# EasyEDA schematic SCH_TestPCB_2024-04-18.json
TITLE: FletchVR; REV: 1.0; Date: 2024-02-04; Sheet: 1/1; Drawn By: Fletchworks; Company: Fletchworks
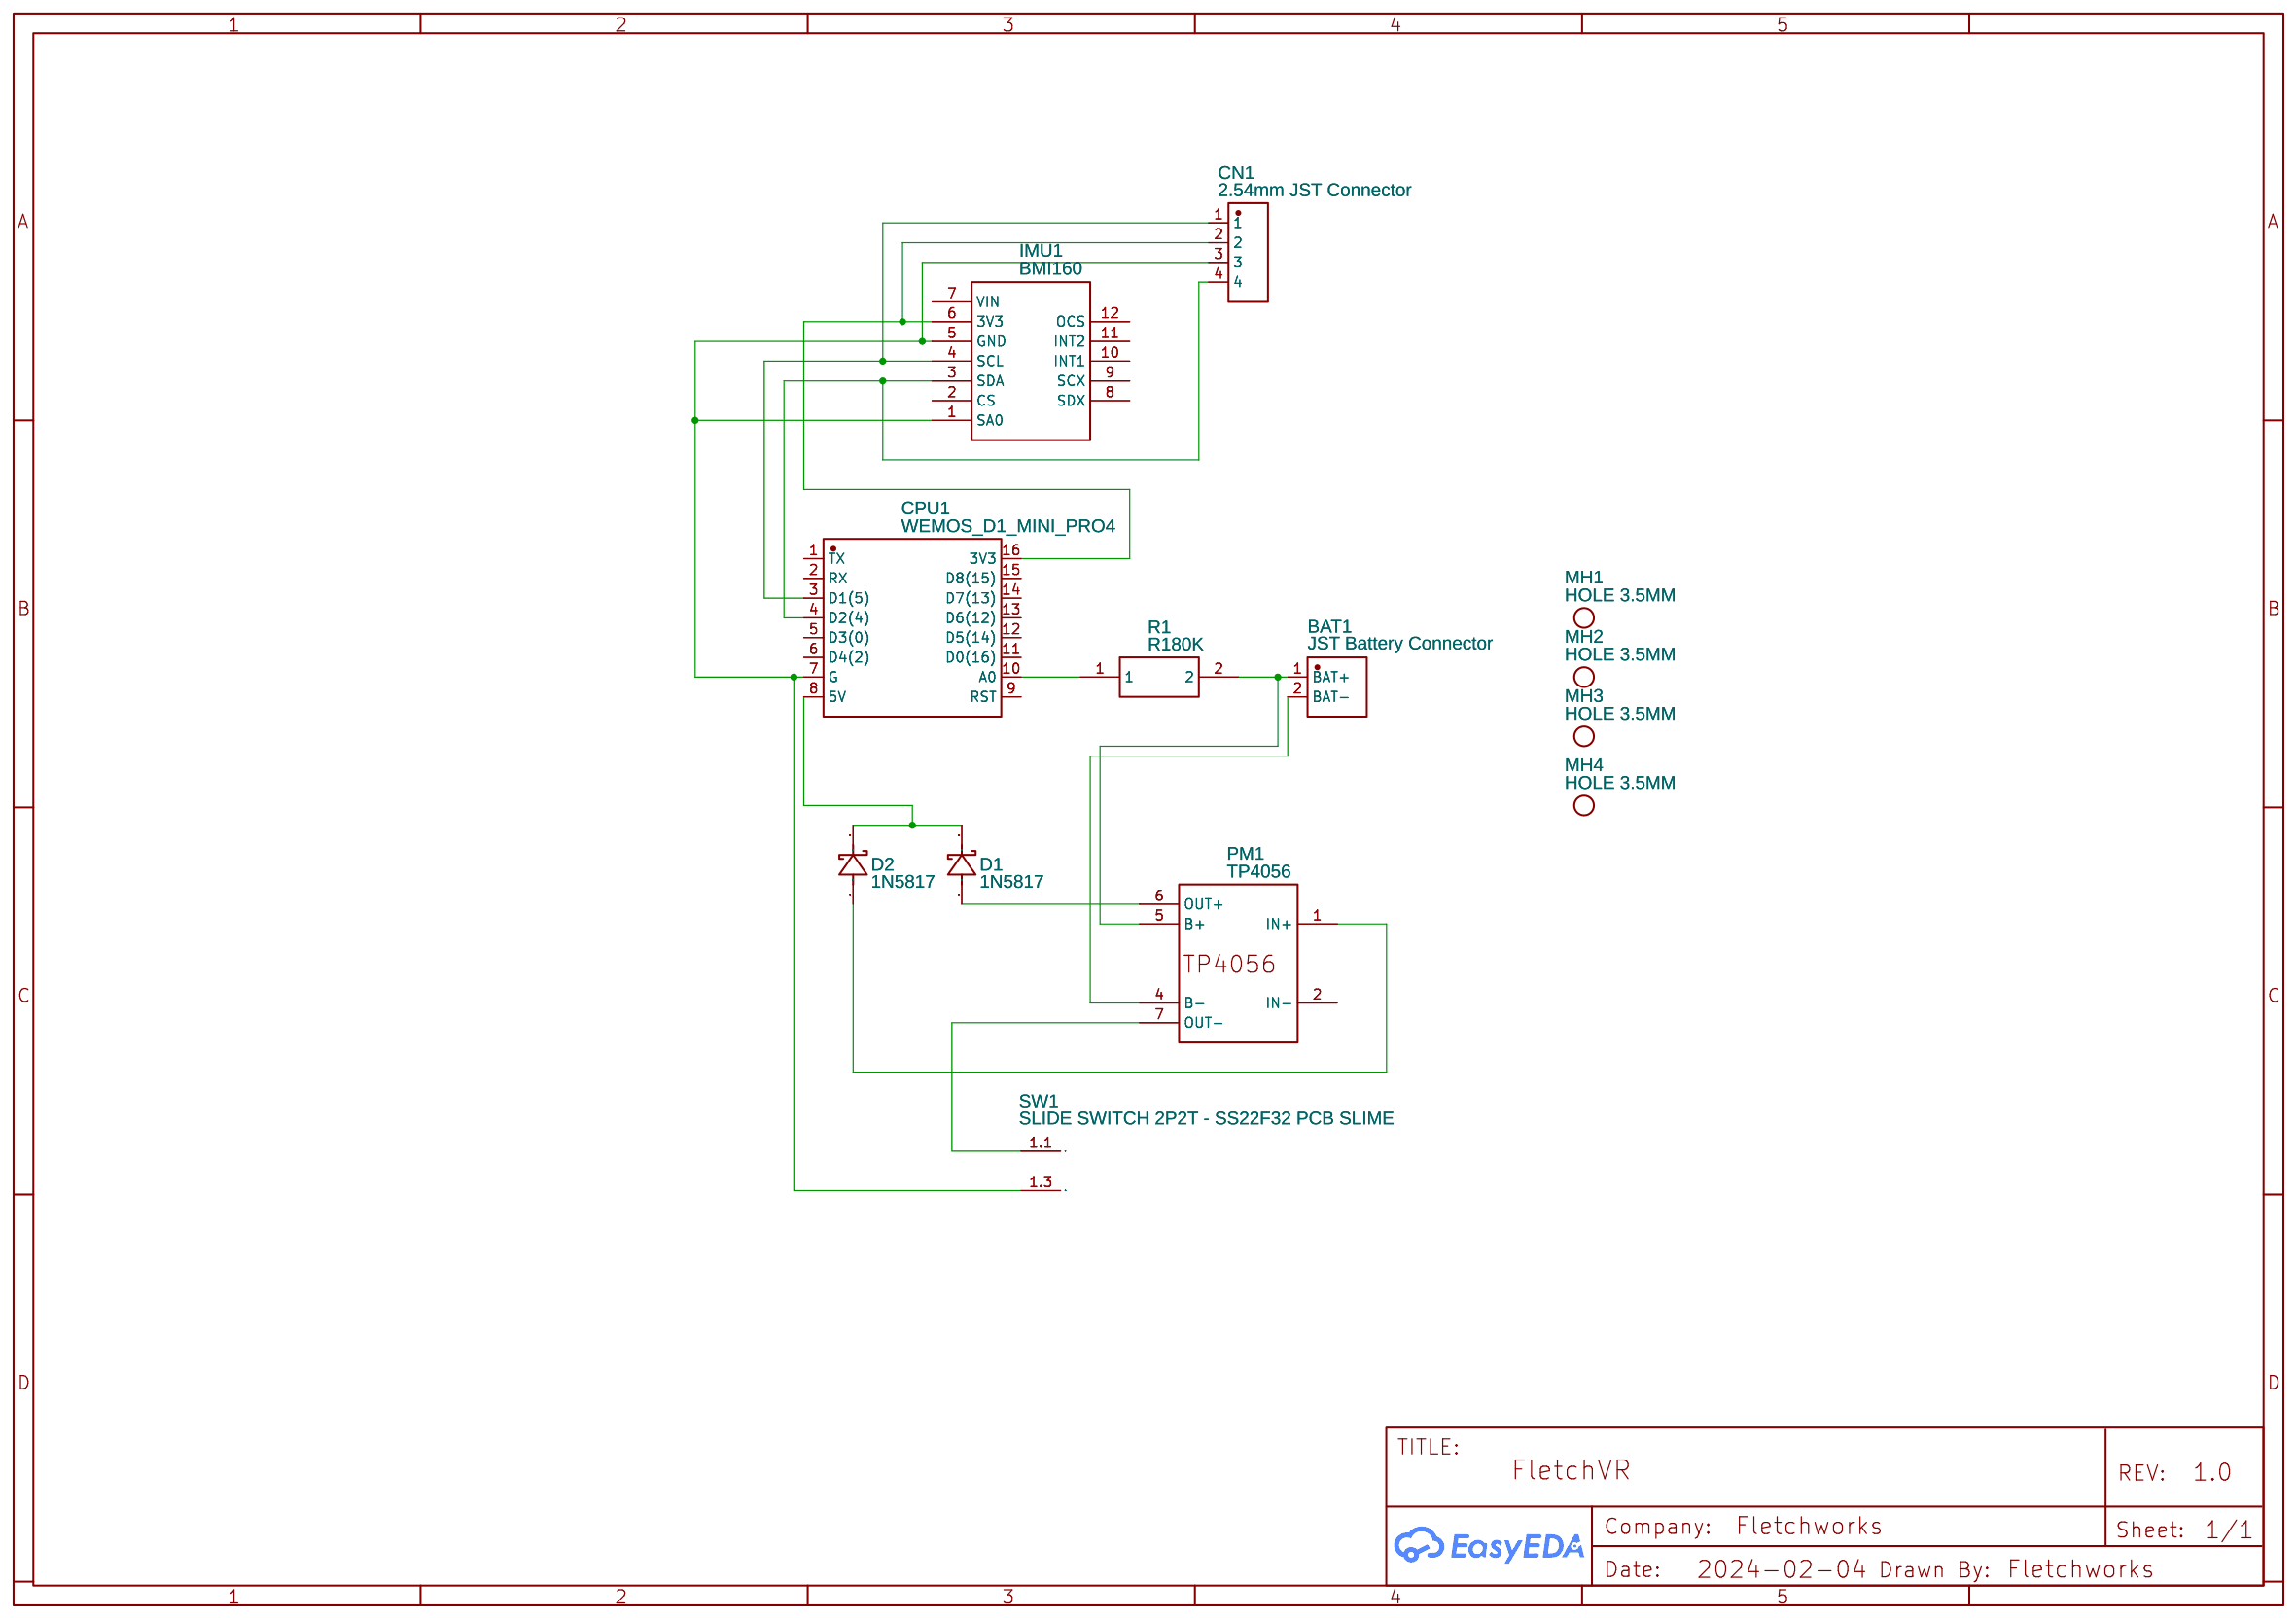
[diagram p0: schematic sheet]

## Parts
BAT1  JST Battery Connector  [JST-PH-JST-PH2]
CN1  2.54mm JST Connector  [CONN-TH_4P-P2.54_XH-AW-2.54MM-4P]
CPU1  WEMOS_D1_MINI_PRO4  [DIP-16_WEMOS_D1_MINI_PRO4]
D1  1N5817  [1N5817_THROUGH]
D2  1N5817  [1N5817_THROUGH]
IMU1  BMI160  [BMI160]
MH1  HOLE 3.5MM  [HOLE-3.5MM]
MH2  HOLE 3.5MM  [HOLE-3.5MM]
MH3  HOLE 3.5MM  [HOLE-3.5MM]
MH4  HOLE 3.5MM  [HOLE-3.5MM]
PM1  TP4056  [TP4056-SIZ]
R1  R180K  [ER RESISTOR 180K/0.6 W]
SW1  SLIDE SWITCH 2P2T - SS22F32 PCB SLIME  [2P2T-SS22F32]

## Library data of the parts
BAT1 = JST-PH-JST-PH2 COPY: Contributor: julian.boet
CN1 = XH-AW-2.54MM-4P: Contributor: lcsc; Supplier: LCSC; Supplier Part: C9900018797; Manufacturer: null; JLCPCB Part Class: Extended Part
CPU1 = WEMOS_D1_MINI_PRO4: Contributor: LCSC; Supplier: LCSC; Supplier Part: C2837266; Manufacturer: null; Manufacturer Part: Wemos_D1_mini_Pro4; JLCPCB Part Class: Extended Part
D1 D2 = 1N5817: Contributor: siddharth13sahu
IMU1 = BMI160: Contributor: katze2005
MH1-MH4 = HOLE 3.5MM: Contributor: Ahmad Ahmad Kassem
PM1 = TP4056-siz: Manufacturer Part: TP4056-protect; link: https://dlnmh9ip6v2uc.cloudfront.net/datasheets/Prototyping/TP4056.pdf; Contributor: klyvacreative24
R1 = R180K: Contributor: Witlon
SW1 = SLIDE SWITCH 2P2T - SS22F32 PCB SLIME: Manufacturer Part: SS22F32; Supplier Part: SS22F32; Supplier: AliExpress; Link: https://www.aliexpress.com/item/High-Quality-10-Pcs-2-Position-DPDT-2P2T-Panel-Mount-Vertical-Slide-Switch-6-Pin-0/32738051861.html?spm=2114.13010708.0.0.skYvMp; Price (USD): 0.13; Contributor: huhwhyareyouhere

## Nets
Net-(BAT1-1): BAT1.1(BAT+) PM1.5(B+) R1.2
Net-(BAT1-2): BAT1.2(BAT-) PM1.4(B-)
Net-(CN1-1): CN1.1 CPU1.3(D1(5)) IMU1.4(SCL)
Net-(CN1-2): CN1.2 CPU1.16(3V3) IMU1.6(3V3)
Net-(CN1-3): CN1.3 CPU1.7(G) IMU1.1(SA0) IMU1.5(GND) SW1.1.3(2)
Net-(CN1-4): CN1.4 CPU1.4(D2(4)) IMU1.3(SDA)
Net-(CPU1-8): CPU1.8(5V) D1.2 D2.2
Net-(CPU1-10): CPU1.10(A0) R1.1
Net-(D1-1): D1.1 PM1.6(OUT+)
Net-(D2-1): D2.1 PM1.1(IN+)
Net-(PM1-7): PM1.7(OUT-) SW1.1.1(1)

Not connected (* = marked no-connect by the designer): CPU1 1(TX) 2(RX) 5(D3(0)) 6(D4(2)) 9(RST) 11(D0(16)) 12(D5(14)) 13(D6(12)) 14(D7(13)) 15(D8(15)); IMU1 2(CS) 7(VIN) 8(SDX) 9(SCX) 10(INT1) 11(INT2) 12(OCS); PM1 2(IN-)
